# Altium schematic sheet 5V5_BOOST.SchDoc: 5V5 BOOST
size 431 x 279 mm; ApprovedBy: Wuji Zhang; CheckedBy: Wuji Zhang; Author: Wuji Zhang; DrawnBy: Wuji Zhang; Organization: Upenn; Address1: ADDRESS 1; Address2: ADDRESS 2; Address3: ADDRESS 3; Address4: ADDRESS 4; Revision: -; SheetNumber: 3; SheetTotal: 8; ENG_APP_DATE: --/--/--; DSN_APP_DATE: --/--/--; CHK_APP_DATE: --/--/--
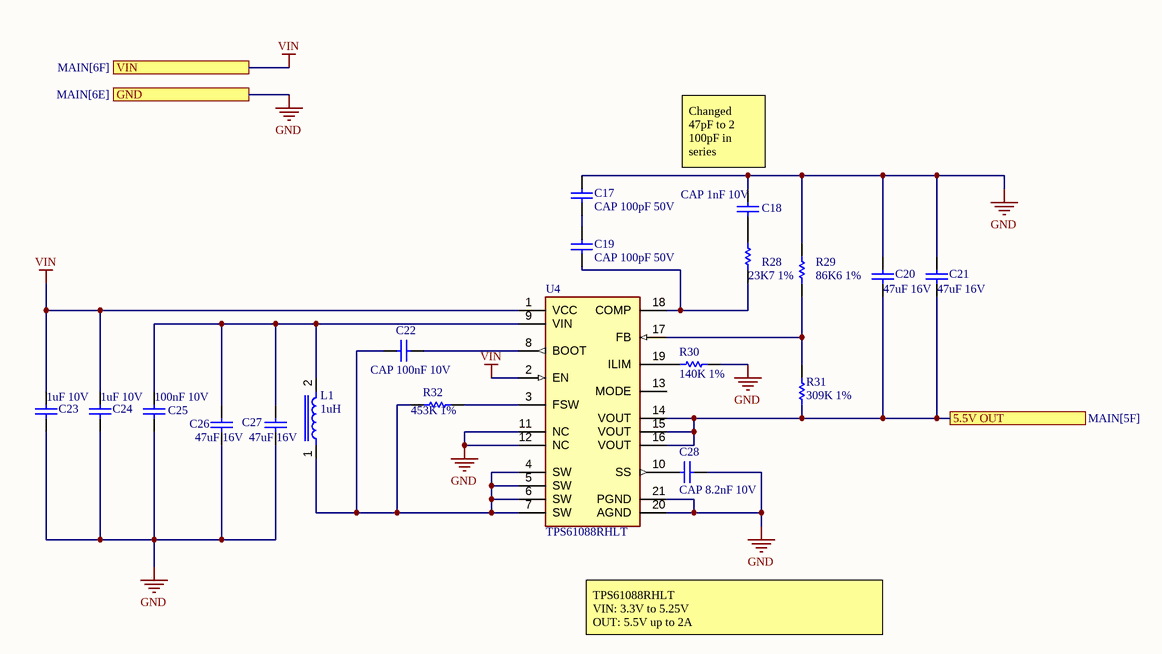
[diagram p0: 5V5_BOOST.SchDoc]

## Parts
C17  CAP 100pF 50V  [CAPC0603(1608)100_L]
C18  CAP 1nF 10V  [CAPC0603(1608)100_M]
C19  CAP 100pF 50V  [CAPC0603(1608)100_L]
C20  47uF 16V  [MURA-1210_H_2.7_L]
C21  47uF 16V  [MURA-1210_H_2.7_L]
C22  CAP 100nF 10V  [CAPC0603(1608)100_L]
C23  1uF 10V  [CAPC0603(1608)100_M]
C24  1uF 10V  [CAPC0603(1608)100_M]
C25  100nF 10V  [CAPC0603(1608)100_L]
C26  47uF 16V  [MURA-1210_H_2.7_L]
C27  47uF 16V  [MURA-1210_H_2.7_L]
C28  CAP 8.2nF 10V  [CAPC0603(1608)100_N]
L1  1uH  [SRP6540-1R0M]
R28  23K7 1%  [RESC0402(1005)_L]
R29  86K6 1%  [RESC0402(1005)_L]
R30  140K 1%  [RESC0402(1005)_M]
R31  309K 1%  [RESC0402(1005)_N]
R32  453K 1%  [RESC0402(1005)_L]
U4  TPS61088RHLT  [FP-RHL0020A-MFG]

## Ports
5.5V OUT (see MAIN[5F]), GND (see MAIN[6E]), VIN (see MAIN[6F])

## Nets
GND: C17.2 C18.2 C20.1 C21.2 C23.1 C24.1 C25.1 C26.2 C27.1 C28.1 R29.1 R30.2 U4.11(NC) U4.12(NC) U4.20(AGND) U4.21(PGND) ; port GND
VIN: C23.2 C24.2 U4.1(VCC) U4.2(EN) ; port VIN
5.5V OUT: C20.2 C21.1 R31.1 U4.14(VOUT) U4.15(VOUT) U4.16(VOUT) ; port 5.5V OUT
NetC17_1: C17.1 C19.2
NetC18_1: C18.1 R28.2
NetC19_1: C19.1 R28.1 U4.18(COMP)
NetC22_1: C22.1 U4.8(BOOT)
NetC22_2: C22.2 L1.1 R32.1 U4.4(SW) U4.5(SW) U4.6(SW) U4.7(SW)
NetC25_2: C25.2 C26.1 C27.2 L1.2 U4.9(VIN)
NetC28_2: C28.2 U4.10(SS)
NetR29_2: R29.2 R31.2 U4.17(FB)
NetR30_1: R30.1 U4.19(ILIM)
NetR32_2: R32.2 U4.3(FSW)

Not connected (* = marked no-connect by the designer): U4 13(MODE)

## Notes on the sheet
- (near C18) Changed 47pF to 2 100pF in series
- TPS61088RHLT
  VIN: 3.3V to 5.25V
  OUT: 5.5V up to 2A
- DWG. NO.
- REV.
- SHT.
- THIS DOCUMENT AND THE DATA DISCLOSED HEREIN OR HEREWITH IS THE PROPERTY OF ALTIUM LIMITED AND MAY BE FREELY DISTRIBUTED IN WHOLE. NO RIGHTS ARE RESERVED OR EXPRESS OR IMPLIED WARANTEE GIVEN.
- REVISION
- DESCRIPTION
- DATE
- APPROVED
- ENG:
- APPROVALS
- PROJECT
- DSN:
- CHK:
- REFERENCE DOCUMENTS
- PROJECT REVISION:
- TITLE
- DOCUMENT REVISION:
- DESIGN ITEM:
- BOM:
- FAB DWG:
- PCB DWG:
- ASSY DWG:
- SCALE:
- SIZE
- B
- CAGE CODE
- FILE NAME
- DWG NO.
- SHEET
- OF
- REV

## Library data of the parts
C17 C19 = CMP-1035-01271-1: CAP 100pF 50V ±20% 0603 (1608 Metric) Thickness 1mm SMD; Case-Metric: 1608; Tolerance: Â±20%; Case-EIA: 0603; Max Thickness: 1 mm; Technology: SMT; Value: 100pF; Rated Voltage: 50 V
C18 = CMP-1035-01871-1: CAP 1nF 10V ±1% 0603 (1608 Metric) Thickness 1mm SMD; Tolerance: Â±1%; Case-Metric: 1608; Case-EIA: 0603; Technology: SMT; Rated Voltage: 10 V; Value: 1nF; Max Thickness: 1 mm
C20 C21 C26 C27 = CMP-2000-06362-1: Cap Ceramic, 47 uF, +/- 10%, -55 to 85 degC, 2-Pin SMD (1210), RoHS, Tape and Reel; Manufacturer: Murata; Catalog Drawings: GRMSeries_1210_2.5; Capacitance: 47µF; Product Training Modules: High-CapMultilayerCeramicCapacitors; Temperature Coefficient: X5R; Online Catalog: GRMSeries; Other Names: 490-6539-6; Lead Style: -; Voltage Rating DC: 16V; Datasheet URL: http://psearch.en.murata.com/capacitor/product/GRM32ER61C476KE15%23.pdf; Package Description: 2-Pin Surface Mount Device, Body 3.2 x 2.5 mm; Applications: GeneralPurpose; Thickness (Max): 0.106"(2.70mm); Operating Temperature: -55°C~85°C; Mounting Technology: SurfaceMount; Category: Capacitors; Package / Case: 1210(3225Metric); Mounting Type: SurfaceMount,MLCC; Ratings: -; Package Reference: 1210; Height - Seated (Max): -; Series: GRM; Lead Spacing: -; Family: CeramicCapacitors; Datasheet Version: 04/2016; Tolerance: ±10%; Size / Dimension: 0.126"Lx0.098"W(3.20mmx2.50mm); Packaging: Digi-Reel®; Voltage - Rated: 16V; Standard Package: 1; Features: -; Manufacturer URL: http://www.murata.com/
C22 C25 = CMP-1035-02579-1: CAP 100nF 10V ±5% 0603 (1608 Metric) Thickness 1mm SMD; Tolerance: Â±5%; Case-EIA: 0603; Case-Metric: 1608; Value: 100nF; Max Thickness: 1 mm; Rated Voltage: 10 V; Technology: SMT
C23 C24 = CMP-1035-02733-1: CAP 1uF 10V ±10% 0603 (1608 Metric) Thickness 1mm SMD; Tolerance: Â±10%; Case-EIA: 0603; Case-Metric: 1608; Rated Voltage: 10 V; Max Thickness: 1 mm; Value: 1uF; Technology: SMT
C28 = CMP-1035-02280-1: CAP 8.2nF 10V ±5% 0603 (1608 Metric) Thickness 1mm SMD; Tolerance: Â±5%; Case-Metric: 1608; Case-EIA: 0603; Max Thickness: 1 mm; Technology: SMT; Rated Voltage: 10 V; Value: 8.2nF
L1 = SRP6540-1R0M: BOURNS - SRP6540-1R0M - Cewka mocy (SMD), 1 µH, 12 A, Osloniete, 13.5 A, Seria SRP6540, 7.2mm x 6.5mm x 4mm; Core Material: Ferrite; Tolerance: 20%; Shielding: Shielded; Current Rating: 12A; Saturation Current: 13.5A; DC Resistance (DCR): 7.2mR; Test Frequency: 100kHz; MF: Bourns; Purchase-URL: https://pricing.snapeda.com/search/part/SRP6540-1R0M/?ref=eda; SnapEDA_Link: https://www.snapeda.com/parts/SRP6540-1R0M/Bourns/view-part/1499791/?ref=snap; MP: SRP6540-1R0M; Price: None; Package: Nonstandard Bourns; Check_prices: https://www.snapeda.com/parts/SRP6540-1R0M/Bourns/view-part/1499791/?ref=eda; Value: *; Availability: Good; Supplier 1: Digi-Key; Supplier Part Number 1: SRP6540-1R0MCT-ND; Manufacturer: Bourns; Manufacturer Part Number: SRP6540-1R0M; RoHS: Yes; Category: Fixed Inductors; Stock 1: 72210; Pricing 1: 1=1.36000, 10=1.26300, 25=1.16560, 50=0.97120, 100=0.91300, 250=0.81584, 500=0.69930 (USD); Mount: Surface Mount; Case/Package: 2826; Number of Pins: 2; Material: Ferrite; Min Operating Temperature: -55°C; Max Operating Temperature: 125°C; Inductance: 1uH; Packaging: Tape and Reel; Package Quantity: 1200; Inductance Tolerance: 20%; Resistor Type: Wirewound; Max DC Current: 12A; Termination: SMD/SMT; RMS Current (Irms): 12A; Self Resonant Frequency: 100kHz; Series: SRP6540; Sample Rate (Hz): 100kHz; Length: 7.2mm; Width: 6.5mm; Height: 4mm; Height - Seated (Max): 0.157inch; Depth: 6.7mm; REACH SVHC: No SVHC; Military Standard: Not; RoHS Compliant: Yes; ComponentLink1URL: https://datasheet.ciiva.com/28679/1698468-28679543.pdf?src-supplier=Element14; ComponentLink1Description: https://datasheet.ciiva.com/28679/1698468-28679543.pdf?src-supplier=Element14; ComponentLink2URL: https://datasheet.ciiva.com/22667/1698468-22667145.pdf?src-supplier=Element14; ComponentLink2Description: https://datasheet.ciiva.com/22667/1698468-22667145.pdf?src-supplier=Element14; ComponentLink3URL: https://datasheet.ciiva.com/17052/70281705-17052171.pdf?src-supplier=Allied+Electronics; ComponentLink3Description: https://datasheet.ciiva.com/17052/70281705-17052171.pdf?src-supplier=Allied+Electronics
R28 = CMP-1011-00663-1: 23K7 0.063W 1% 0402 (1005 Metric)  SMD; Case-Metric: 1005; Case-EIA: 0402; Value: 23700.00 Ohm; Tolerance: 1 %; Technology: SMT; Power: 0.063 W
R29 = CMP-1011-00729-1: 86K6 0.063W 1% 0402 (1005 Metric)  SMD; Case-EIA: 0402; Value: 86600.00 Ohm; Case-Metric: 1005; Technology: SMT; Tolerance: 1 %; Power: 0.063 W
R30 = CMP-1011-00751-1: 140K 0.063W 1% 0402 (1005 Metric)  SMD; Case-EIA: 0402; Case-Metric: 1005; Value: 140000.00 Ohm; Tolerance: 1 %; Technology: SMT; Power: 0.063 W
R31 = CMP-1011-00790-1: 309K 0.063W 1% 0402 (1005 Metric)  SMD; Value: 309000.00 Ohm; Case-EIA: 0402; Case-Metric: 1005; Tolerance: 1 %; Technology: SMT; Power: 0.063 W
R32 = CMP-1011-00810-1: 453K 0.063W 1% 0402 (1005 Metric)  SMD; Value: 453000.00 Ohm; Case-Metric: 1005; Case-EIA: 0402; Tolerance: 1 %; Power: 0.063 W; Technology: SMT
U4 = CMP-04918-000117-1: IC REG BOOST ADJ 10A 20VQFN; Manufacturer: Texas Instruments; Output Voltage: 4.5-12.6V; Max Junction Temp: +125°C; Max Duty Cycle: 90%; Output Type: AdjustableProgrammable; Nominal Supply Current: 1-110uA; Min Supply Voltage: 2.7V; Switching Frequency: 200-2200kHz; Number Of Outputs: 1; Max Supply Voltage: 12V; Manufacturer Part Number: TPS61088RHLT; Digikey Description: IC REG BOOST ADJ 10A 20VQFN; Octopart: https://octopart.com/tps61088rhlt-texas+instruments-57155059; Switching Topology: Boost; Lead Free: Yes; Output Current: 10A; Height: 1mm; Temperature: -40°C to +85°C; Package: RHL0020A; Device Class L3: Voltage Regulators - Switching; RoHS: TRUE; Temperature Range Low: -40°C; Temperature Range High: +85°C; Device Class L1: Integrated Circuits (ICs); Automotive: No; Category: IC; ComponentLink2Description: Datasheet; ComponentLink2URL: http://www.ti.com/lit/ds/symlink/tps61088.pdf; Device Class L2: Power Management ICs